# Altium schematic sheet 智能车控制板.SchDoc
size A3; SheetNumber: 1; SheetTotal: 1
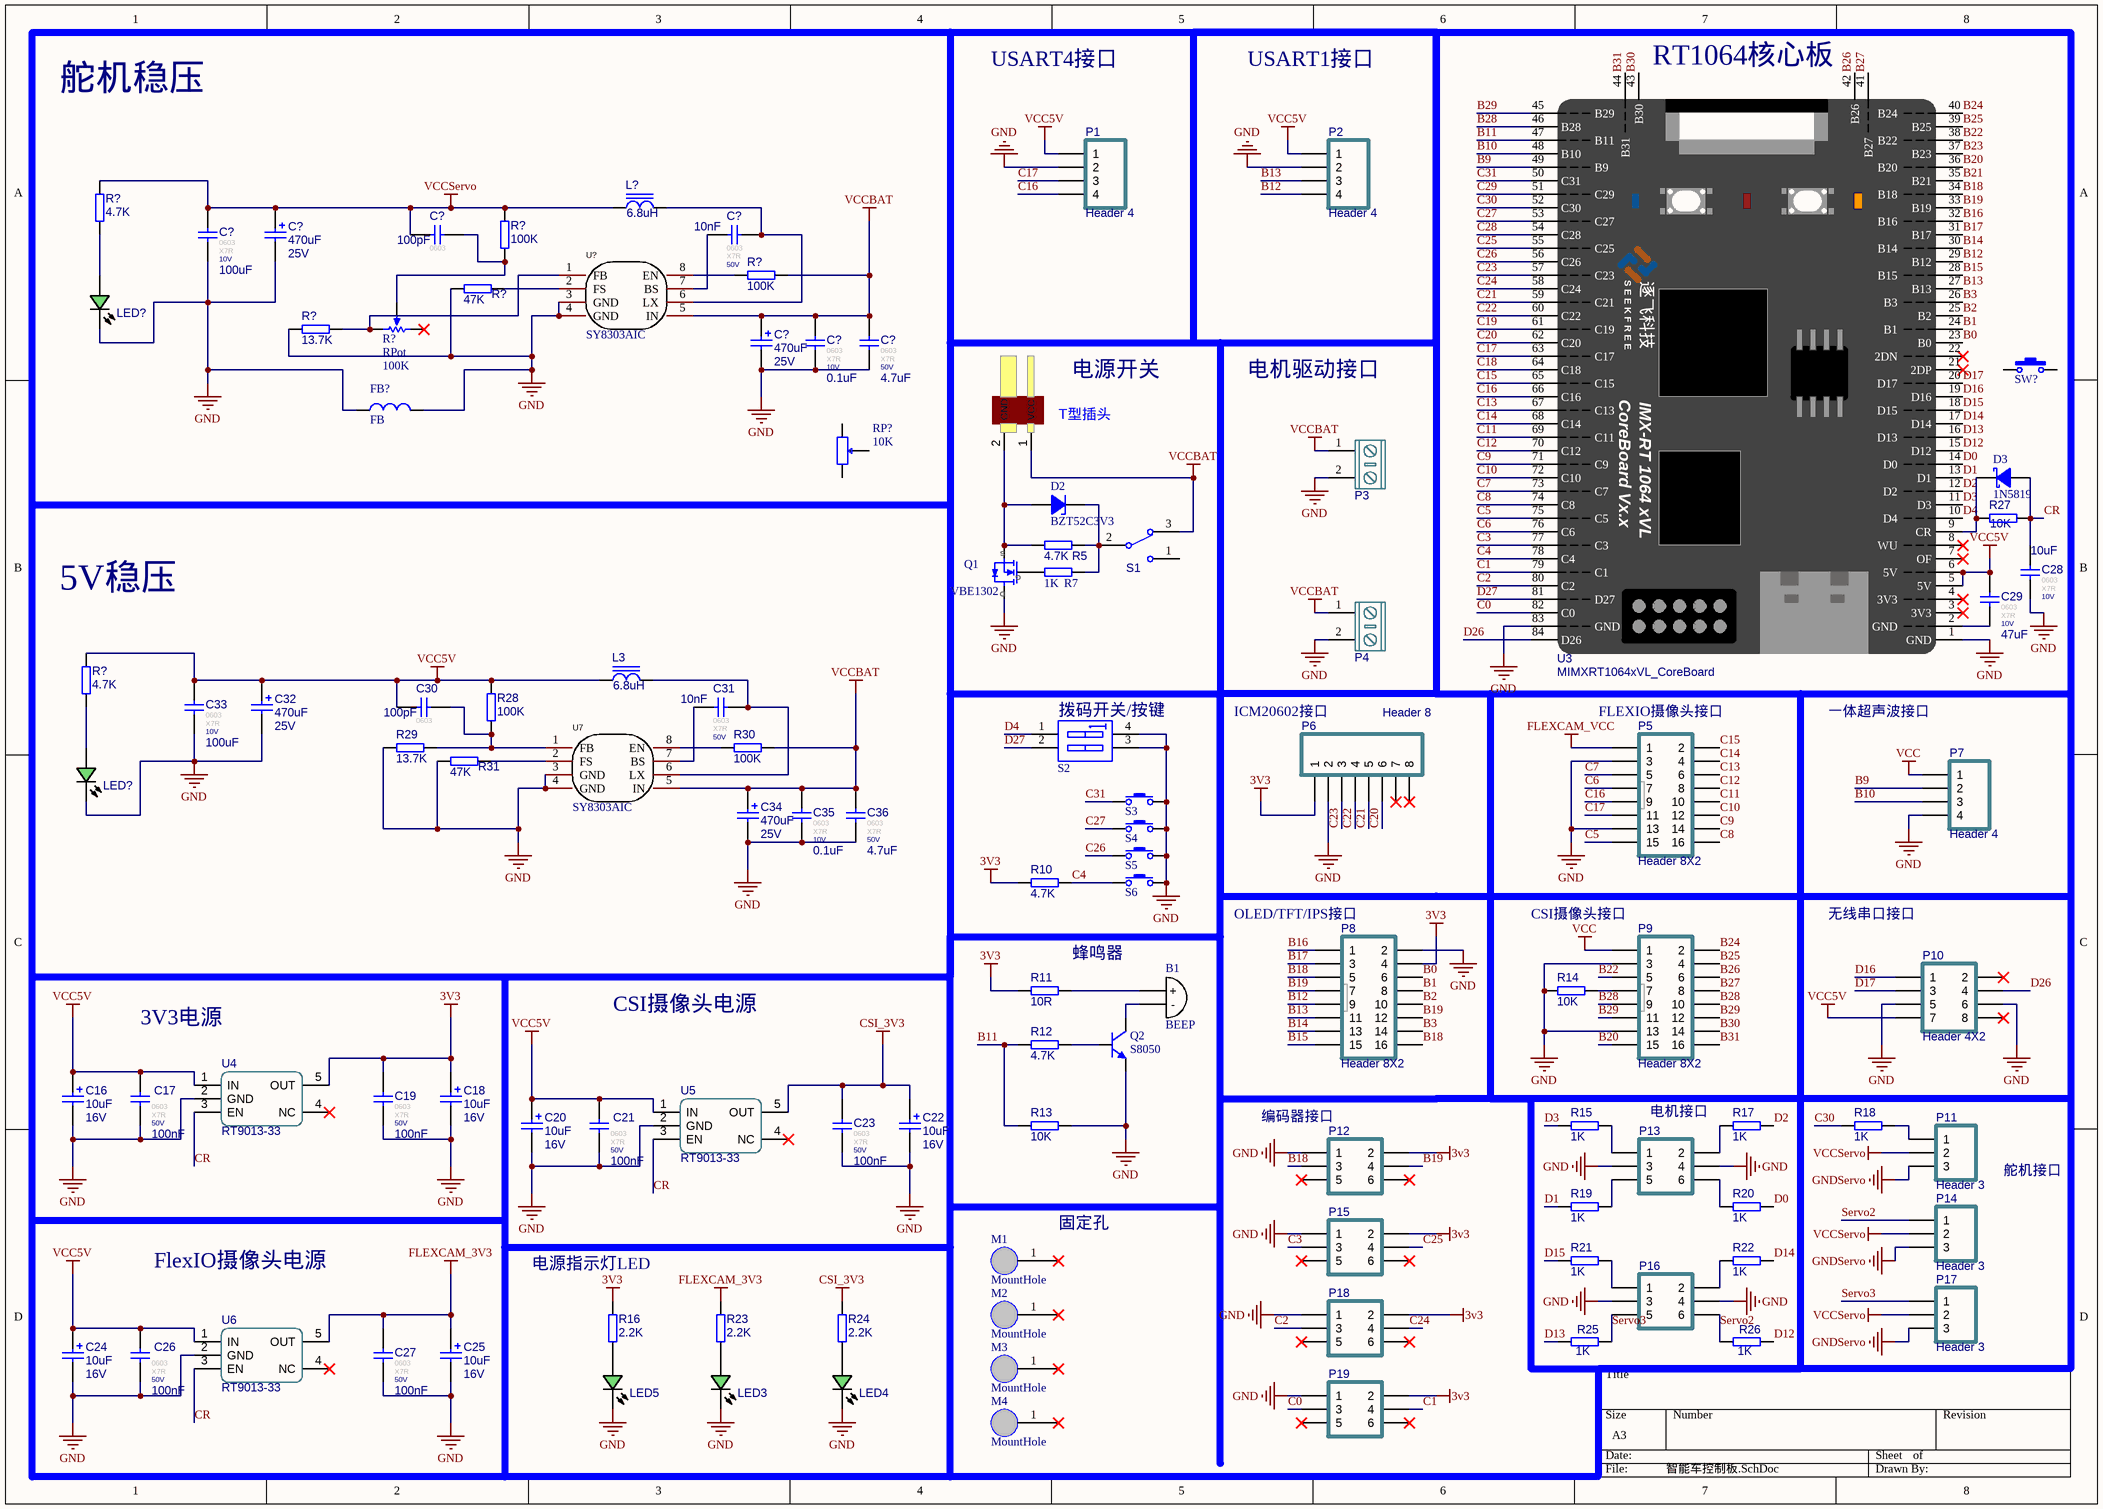
[diagram p0: 智能车控制板.SchDoc]

## Parts
(Parts that share a designator on the sheet are numbered #1, #2 ... from top to bottom, then left to right.)
B1  BEEP  [BEEP 9x5.5mm]
C16  value 10uF  Voltage: 16V  [CAPS6.3]  (hidden comment: 10uF 16V)
C17  value 100nF  Footprint: 0603  Type: X7R  Voltage: 50V  [CAPC1608[0603]S-L]  (hidden comment: 100nF ±10% 50V)
C18  value 10uF  Voltage: 16V  [CAPS6.3]  (hidden comment: 10uF 16V)
C19  value 100nF  Footprint: 0603  Type: X7R  Voltage: 50V  [CAPC1608[0603]S-L]  (hidden comment: 100nF ±10% 50V)
C20  value 10uF  Voltage: 16V  [CAPS6.3]  (hidden comment: 10uF 16V)
C21  value 100nF  Footprint: 0603  Type: X7R  Voltage: 50V  [CAPC1608[0603]S-L]  (hidden comment: 100nF ±10% 50V)
C22  value 10uF  Voltage: 16V  [CAPS6.3]  (hidden comment: 10uF 16V)
C23  value 100nF  Footprint: 0603  Type: X7R  Voltage: 50V  [CAPC1608[0603]S-L]  (hidden comment: 100nF ±10% 50V)
C24  value 10uF  Voltage: 16V  [CAPS6.3]  (hidden comment: 10uF 16V)
C25  value 10uF  Voltage: 16V  [CAPS6.3]  (hidden comment: 10uF 16V)
C26  value 100nF  Footprint: 0603  Type: X7R  Voltage: 50V  [CAPC1608[0603]S-L]  (hidden comment: 100nF ±10% 50V)
C27  value 100nF  Footprint: 0603  Type: X7R  Voltage: 50V  [CAPC1608[0603]S-L]  (hidden comment: 100nF ±10% 50V)
C28  value 10uF  Footprint: 0603  Type: X7R  Voltage: 10V  [CAPC1608[0603]S-L]  (hidden comment: 10uF ±10% 10V)
C29  value 47uF  Footprint: 0603  Type: X7R  Voltage: 10V  [CAPC1608[0603]S-L]  (hidden comment: 47uF ±10% 10V)
C30  value 100pF  Footprint: 0603  [CAPC1608[0603]S-L]  (hidden comment: 100pF ±10% 50V)
C31  value 10nF  Footprint: 0603  Type: X7R  Voltage: 50V  [CAPC1608[0603]S-L]  (hidden comment: 10nF ±10% 50V)
C32  value 470uF  Voltage: 25V  [CAPS6.3]  (hidden comment: 470uF 25V)
C33  value 100uF  Footprint: 0603  Type: X7R  Voltage: 10V  [CAPC1608[0603]S-L]  (hidden comment: 100uF ±10% 10V)
C34  value 470uF  Voltage: 25V  [CAPS6.3]  (hidden comment: 470uF 25V)
C35  value 0.1uF  Footprint: 0603  Type: X7R  Voltage: 10V  [CAPC1608[0603]S-L]  (hidden comment: 0.1uF ±10% 10V)
C36  value 4.7uF  Footprint: 0603  Type: X7R  Voltage: 50V  [CAPC1608[0603]S-L]  (hidden comment: 4.7uF ±10% 50V)
C?#1  value 470uF  Voltage: 25V  [CAPS6.3]  (hidden comment: 470uF 25V)
C?#2  value 100pF  Footprint: 0603  [CAPC1608[0603]S-L]  (hidden comment: 100pF ±10% 50V)
C?#3  value 10nF  Footprint: 0603  Type: X7R  Voltage: 50V  [CAPC1608[0603]S-L]  (hidden comment: 10nF ±10% 50V)
C?#4  value 100uF  Footprint: 0603  Type: X7R  Voltage: 10V  [CAPC1608[0603]S-L]  (hidden comment: 100uF ±10% 10V)
C?#5  value 470uF  Voltage: 25V  [CAPS6.3]  (hidden comment: 470uF 25V)
C?#6  value 0.1uF  Footprint: 0603  Type: X7R  Voltage: 10V  [CAPC1608[0603]S-L]  (hidden comment: 0.1uF ±10% 10V)
C?#7  value 4.7uF  Footprint: 0603  Type: X7R  Voltage: 50V  [CAPC1608[0603]S-L]  (hidden comment: 4.7uF ±10% 50V)
D2  BZT52C3V3  [SOD-123-L]
D3  1N5819  [SOD-123-L]
DCIN1  T型插头  [Wired T-Header ThroughHole]
FB?  FB  [FB-L0805]
L3  value 6.8uH  [0630 TPC 7*7*3]  (hidden comment: 6.8uH 5A)
L?  value 6.8uH  [0630 TPC 7*7*3]  (hidden comment: 6.8uH 5A)
LED3  翠绿贴片LED  [LEDC1608(0603)-L]  (value not drawn)
LED4  翠绿贴片LED  [LEDC1608(0603)-L]  (value not drawn)
LED5  翠绿贴片LED  [LEDC1608(0603)-L]  (value not drawn)
LED?#1  翠绿贴片LED  [LEDC1608(0603)-L]  (value not drawn)
LED?#2  翠绿贴片LED  [LEDC1608(0603)-L]  (value not drawn)
M1  MountHole  [M3-MountHole]  (no BOM)
M2  MountHole  [M3-MountHole]  (no BOM)
M3  MountHole  [M3-MountHole]  (no BOM)
M4  MountHole  [M3-MountHole]  (no BOM)
P1  Header 4  [HDR1X4]
P2  Header 4  [HDR1X4]
P3  KF/WJ/DG 30x connecter  [KF/WJ/DG 301-2p-5.0mm]  (value not drawn)
P4  KF/WJ/DG 30x connecter  [KF/WJ/DG 301-2p-5.0mm]  (value not drawn)
P5  Header 8X2  [HDR2X8-F-High]
P6  Header 8  [HDR1X8]
P7  Header 4  [HDR1X4]
P8  Header 8X2  [HDR2X8-F-High]
P9  Header 8X2  [HDR2X8-F-High]
P10  Header 4X2  [HDR2X4-F-SMT]
P11  Header 3  [HDR1X3]
P12  Header 3X2  [HDR2X3-M-SMT]  (value not drawn)
P13  Header 3X2  [HDR2X3-M-SMT]  (value not drawn)
P14  Header 3  [HDR1X3]
P15  Header 3X2  [HDR2X3-M-SMT]  (value not drawn)
P16  Header 3X2  [HDR2X3-M-SMT]  (value not drawn)
P17  Header 3  [HDR1X3]
P18  Header 3X2  [HDR2X3-M-SMT]  (value not drawn)
P19  Header 3X2  [HDR2X3-M-SMT]  (value not drawn)
Q1  VBE1302  [VBE1302]
Q2  S8050  [SOT-23]
R5  value 4.7K  [RESC1608[0603]S-L]  (hidden comment: 4.7K ±1%)
R7  value 1K  [RESC1608[0603]S-N]  (hidden comment: 1K ±1%)
R10  value 4.7K  [RESC1608[0603]S-L]  (hidden comment: 4.7K ±1%)
R11  value 10R  [RESC1608[0603]S-L]  (hidden comment: 10R ±1%)
R12  value 4.7K  [RESC1608[0603]S-L]  (hidden comment: 4.7K ±1%)
R13  value 10K  [RESC1608[0603]S-L]  (hidden comment: 10K ±1%)
R14  value 10K  [RESC1608[0603]S-L]  (hidden comment: 10K ±1%)
R15  value 1K  [RESC1608[0603]S-L]  (hidden comment: 1K ±1%)
R16  value 2.2K  [RESC1608[0603]S-L]  (hidden comment: 2.2K ±1%)
R17  value 1K  [RESC1608[0603]S-L]  (hidden comment: 1K ±1%)
R18  value 1K  [RESC1608[0603]S-L]  (hidden comment: 1K ±1%)
R19  value 1K  [RESC1608[0603]S-L]  (hidden comment: 1K ±1%)
R20  value 1K  [RESC1608[0603]S-L]  (hidden comment: 1K ±1%)
R21  value 1K  [RESC1608[0603]S-L]  (hidden comment: 1K ±1%)
R22  value 1K  [RESC1608[0603]S-L]  (hidden comment: 1K ±1%)
R23  value 2.2K  [RESC1608[0603]S-L]  (hidden comment: 2.2K ±1%)
R24  value 2.2K  [RESC1608[0603]S-L]  (hidden comment: 2.2K ±1%)
R25  value 1K  [RESC1608[0603]S-L]  (hidden comment: 1K ±1%)
R26  value 1K  [RESC1608[0603]S-L]  (hidden comment: 1K ±1%)
R27  value 10K  [RESC1608[0603]S-L]  (hidden comment: 10K ±1%)
R28  value 100K  [RESC1608[0603]S-L]  (hidden comment: 100K ±1%)
R29  value 13.7K  [RESC1608[0603]S-L]  (hidden comment: 13.7K ±1%)
R30  value 100K  [RESC1608[0603]S-L]  (hidden comment: 100K ±1%)
R31  value 47K  [RESC1608[0603]S-L]  (hidden comment: 47K ±1%)
R?#1  value 4.7K  [RESC1608[0603]S-L]  (hidden comment: 4.7K ±1%)
R?#2  value 100K  [RESC1608[0603]S-L]  (hidden comment: 100K ±1%)
R?#3  value 100K  [RESC1608[0603]S-L]  (hidden comment: 100K ±1%)
R?#4  value 47K  [RESC1608[0603]S-L]  (hidden comment: 47K ±1%)
R?#5  RPot  value 100K  [VR5]
R?#6  value 13.7K  [RESC1608[0603]S-L]  (hidden comment: 13.7K ±1%)
R?#7  value 4.7K  [RESC1608[0603]S-L]  (hidden comment: 4.7K ±1%)
RP?  10K  [WH148-1-G25]
S1  SW-SPDT  [SS12D10]  (value not drawn)
S2  SW DIP-2  [Code SW-2-DIP-2.54]  (value not drawn)
S3  Button  [PTS810-3*4-CurvePin]  (value not drawn)
S4  Button  [PTS810-3*4-CurvePin]  (value not drawn)
S5  Button  [PTS810-3*4-CurvePin]  (value not drawn)
S6  Button  [PTS810-3*4-CurvePin]  (value not drawn)
SW?  3x6x5  [SW SMD-3*6*2.5]  (value not drawn)
U3  MIMXRT1064xVL_CoreBoard  [MIMXRT1064xVL_CoreBoard - 3D]
U4  RT9013-33  [SOT-23-5]
U5  RT9013-33  [SOT-23-5]
U6  RT9013-33  [SOT-23-5]
U7  SY8303AIC  [TSOT-23-8_L2.9-W1.6-P0.65-LS2.8-BR]
U?  SY8303AIC  [TSOT-23-8_L2.9-W1.6-P0.65-LS2.8-BR]

## Nets
3V3: C18.1 C19.2 P6.1 P8.4 P12.2 P15.2 P18.2 P19.2 R10.1 R11.2 R16.2 U4.5(OUT)
CSI_3V3: C22.1 C23.2 R24.2 U5.5(OUT)
FLEXCAM_3V3: C25.1 C27.2 R23.2 U6.5(OUT)
FLEXCAM_VCC: P5.1
GND: C16.2 C17.1 C18.2 C19.1 C20.2 C21.1 C22.2 C23.1 C24.2 C25.2 C26.1 C27.1 C28.1 C32.2 C33.1 C34.2 C35.1 C36.1 C?#1.2 C?#4.1 C?#5.2 C?#6.1 C?#7.1 FB?.1 FB?.2 LED3.C LED4.C LED5.C LED?#1.C LED?#2.C P1.2 P2.2 P3.2 P4.2 P5.3 P5.13 P6.2 P7.4 P8.2 P9.3 P9.13 P10.5 P10.6 P12.1 P13.3 P13.4 P15.1 P16.3 P16.4 P18.1 P19.1 Q1.1(D) Q2.2(E) R13.1 R14.2 R29.2 R31.2 R?#4.2 R?#6.2 S2.3(B2) S2.4(B1) S3.1 S4.1 S5.1 S6.1 U3.1(GND) U3.83(GND) U4.2(GND) U5.2(GND) U6.2(GND) U7.3(GND) U7.4(GND) U?.3(GND) U?.4(GND)
GNDServo: P11.3 P14.3 P17.3
VCC: P7.1 P9.1
VCC5V: C16.1 C17.2 C20.1 C21.2 C24.1 C26.2 C29.2 C30.1 C32.1 C33.2 L3.1 P1.1 P2.1 P10.7 R28.2 R?#7.2 U3.5(5V) U3.6(5V) U4.1(IN) U5.1(IN) U6.1(IN)
VCCBAT: C34.1 C35.2 C36.2 C?#5.1 C?#6.2 C?#7.2 DCIN1.1(VCC) P3.1 P4.1 R30.1 R?#3.1 S1.3 U7.5(IN) U?.5(IN)
VCCServo: C?#1.1 C?#2.1 C?#4.2 L?.1 P11.2 P14.2 P17.2 R?#1.2 R?#2.2
B0: P8.6 U3.23(B0)
B1: P8.8 U3.24(B1)
B2: P8.10 U3.25(B2)
B3: P8.14 U3.26(B3)
B9: P7.2 U3.49(B9)
B10: P7.3 U3.48(B10)
B11: R12.2 R13.2 U3.47(B11)
B12: P2.4 P8.9 U3.29(B12)
B13: P2.3 P8.11 U3.27(B13)
B14: P8.13 U3.30(B14)
B15: P8.15 U3.28(B15)
B16: P8.1 U3.32(B16)
B17: P8.3 U3.31(B17)
B18: P8.5 P8.16 P12.3 U3.34(B18)
B19: P8.7 P8.12 P12.4 U3.33(B19)
B20: P9.15 U3.36(B20)
B21: U3.35(B21)
B22: P9.5 U3.38(B22)
B23: U3.37(B23)
B24: P9.2 U3.40(B24)
B25: P9.4 U3.39(B25)
B26: P9.6 U3.42(B26)
B27: P9.8 U3.41(B27)
B28: P9.9 P9.10 U3.46(B28)
B29: P9.11 P9.12 U3.45(B29)
B30: P9.14 U3.43(B30)
B31: P9.16 U3.44(B31)
C0: P19.3 U3.82(C0)
C1: P19.4 U3.79(C1)
C2: P18.3 U3.80(C2)
C3: P15.3 U3.77(C3)
C4: R10.2 S6.2 U3.78(C4)
C5: P5.15 U3.75(C5)
C6: P5.7 U3.76(C6)
C7: P5.5 U3.73(C7)
C8: P5.16 U3.74(C8)
C9: P5.14 U3.71(C9)
C10: P5.12 U3.72(C10)
C11: P5.10 U3.69(C11)
C12: P5.8 U3.70(C12)
C13: P5.6 U3.67(C13)
C14: P5.4 U3.68(C14)
C15: P5.2 U3.65(C15)
C16: P1.4 P5.9 U3.66(C16)
C17: P1.3 P5.11 U3.63(C17)
C18: U3.64(C18)
C19: U3.61(C19)
C20: P6.6 U3.62(C20)
C21: P6.5 U3.59(C21)
C22: P6.4 U3.60(C22)
C23: P6.3 U3.57(C23)
C24: P18.4 U3.58(C24)
C25: P15.4 U3.55(C25)
C26: S5.2 U3.56(C26)
C27: S4.2 U3.53(C27)
C28: U3.54(C28)
C29: U3.51(C29)
C30: R18.2 U3.52(C30)
C31: S3.2 U3.50(C31)
CR: C28.2 D3.A R27.1 U4.3(EN) U5.3(EN) U6.3(EN)
D0: R20.1 U3.14(D0)
D1: R19.2 U3.13(D1)
D2: R17.1 U3.12(D2)
D3: R15.2 U3.11(D3)
D4: S2.1(A1) U3.10(D4)
D12: R26.1 U3.15(D12)
D13: R25.2 U3.16(D13)
D14: R22.1 U3.17(D14)
D15: R21.2 U3.18(D15)
D16: P10.1 U3.19(D16)
D17: P10.3 U3.20(D17)
D26: P10.4 U3.84(D26)
D27: S2.2(A2) U3.81(D27)
Servo2: P14.1 P16.6 R26.2
Servo3: P16.5 P17.1 R25.1
NetB1_1: B1.1(+) R11.1
NetB1_2: B1.2(-) Q2.3(C)
NetC29_1: C29.1 U3.2(GND)
NetC30_2: C30.2 R28.1 R29.1 U7.1(FB)
NetC31_1: C31.1 L3.2 U7.6(LX)
NetC31_2: C31.2 U7.7(BS)
NetC?#2_2: C?#2.2 R?#2.1 R?#5.3(TAP)
NetC?#3_1: C?#3.1 L?.2 U?.6(LX)
NetC?#3_2: C?#3.2 U?.7(BS)
NetD2_A: D2.A DCIN1.2(GND) Q1.3(S) R5.1
NetD2_K: D2.K R5.2 R7.2 S1.2
NetD3_K: D3.K R27.2 U3.9(CR)
NetLED3_A: LED3.A R23.1
NetLED4_A: LED4.A R24.1
NetLED5_A: LED5.A R16.1
NetLED?#1_A: LED?#1.A R?#1.1
NetLED?#2_A: LED?#2.A R?#7.1
NetP9_7: P9.7 R14.1
NetP11_1: P11.1 R18.1
NetP13_1: P13.1 R15.1
NetP13_2: P13.2 R17.2
NetP13_5: P13.5 R19.1
NetP13_6: P13.6 R20.2
NetP16_1: P16.1 R21.1
NetP16_2: P16.2 R22.2
NetQ1_2: Q1.2(G) R7.1
NetQ2_1: Q2.1(B) R12.1
NetR30_2: R30.2 U7.8(EN)
NetR31_1: R31.1 U7.2(FS)
NetR?#3_2: R?#3.2 U?.8(EN)
NetR?#4_1: R?#4.1 U?.2(FS)
NetR?#5_2: R?#5.2(BOT) R?#6.1 U?.1(FB)

Not connected (* = marked no-connect by the designer): M1 1*; M2 1*; M3 1*; M4 1*; P6 7* 8*; P10 2* 8*; P12 5* 6*; P15 5* 6*; P18 5* 6*; P19 5* 6*; R?#5 1(TOP)*; RP? 1 2 3; S1 1; SW? 1 2; U3 3(3V3)* 4(3V3)* 7(OF)* 8(WU)* 21(2DP)* 22(2DN)*; U4 4(NC)*; U5 4(NC)*; U6 4(NC)*

## Notes on the sheet
- 舵机稳压
- USART4接口
- USART1接口
- (near U3) RT1064核心板
- 电源开关
- 电机驱动接口
- 5V稳压
- (near S2) 拨码开关/按键
- ICM20602接口
- (near P5) FLEXIO摄像头接口
- 一体超声波接口
- (near P8) OLED/TFT/IPS接口
- CSI摄像头接口
- 无线串口接口
- (near R11) 蜂鸣器
- 3V3电源
- CSI摄像头电源
- (near P12) 编码器接口
- 电机接口
- 舵机接口
- (near M1) 固定孔
- FlexIO摄像头电源
- (near R16) 电源指示灯LED
- (in symbol MIMXRT1064xVL_CoreBoard) S E E K F R E E; 逐飞科技; CoreBoard Vx.x; IMX-RT 1064 xVL

## Library data of the parts
B1 = BEEP: 蜂鸣器
C16 C18 C20 C22 C24 C25 C32 C34 C?#1 C?#5 = Cap-Solid: Polarized Capacitor (Radial); Published: 8-Jun-2000; Revision: July-2002: Re-released for DXP Platform.; Publisher: Altium Limited; Price(RMB): 0.000
C17 C19 C21 C23 C26 C27 C31 C36 C?#3 C?#7 = Cap-Chip_2: 贴片电容; Published: 2021-12-13; Revision: V1.2; Tolerance: ±10%
C28 C29 C33 C35 C?#4 C?#6 = Cap-Chip: 贴片电容; Published: 2021-12-13; Revision: V1.2; Tolerance: ±10%
C30 C?#2 = Cap-Chip_2: 贴片电容; Type: X7R; Published: 2021-12-13; Revision: V1.2; Tolerance: ±10%; Voltage: 50V
D2 = Diode Zen: 3.3V稳压二极管 SOD-123; Published: 8-Jun-2000; Revision: July-2002: Re-released for DXP Platform.; Publisher: Altium Limited; Price(RMB): 0.000
D3 = Diode Schottky: 肖特基二极管 Diode; Imax: 500mA; Published: 8-Jun-2000; Revision: July-2002: Re-released for DXP Platform.; Publisher: Altium Limited; Price(RMB): 0.000; PartNumber: 1N5819
DCIN1 = T_Header
FB? = FB: 磁珠
L3 L? = Ind-Power: 功率电感; DCR: .5m; Published: 8-Jun-2000; Revision: July-2002: Re-released for DXP Platform.; Publisher: Altium Limited; Price(RMB): 0.000; Imax: 5A
LED3-LED5 LED?#1 LED?#2 = LED Chip Green: Published: 8-Jun-2000; Revision: July-2002: Re-released for DXP Platform.; Publisher: Altium Limited; Price(RMB): 0.00
M1-M4 = MountHole: 固定孔
P1 P2 P7 = Header 4: Header, 4-Pin; LatestRevisionDate: 17-Jul-2002; LatestRevisionNote: Re-released for DXP Platform.; Publisher: Altium Limited; Price(RMB): 0.00
P3 P4 = KF/WJ/DG 30x: 接线端子 2Pin
P5 P8 P9 = Header 8X2: Header, 8-Pin, Dual row; LatestRevisionDate: 17-Jul-2002; LatestRevisionNote: Re-released for DXP Platform.; Publisher: Altium Limited; Price(RMB): 0.00
P6 = Header 8: 8Pin 排针 ICM20602接口; LatestRevisionDate: 17-Jul-2002; LatestRevisionNote: Re-released for DXP Platform.; Publisher: Altium Limited; Price(RMB): 0.00
P10 = Header 4X2: Header, 4-Pin, Dual row; LatestRevisionDate: 17-Jul-2002; LatestRevisionNote: Re-released for DXP Platform.; Publisher: Altium Limited; Price(RMB): 0.00
P11 P14 P17 = Header 3: Header, 3-Pin; LatestRevisionDate: 17-Jul-2002; LatestRevisionNote: Re-released for DXP Platform.; Publisher: Altium Limited; Price(RMB): 0.00
P12 P13 P15 P16 P18 P19 = Header 3X2: Header, 3-Pin, Dual row; LatestRevisionDate: 17-Jul-2002; LatestRevisionNote: Re-released for DXP Platform.; Publisher: Altium Limited; Price(RMB): 0.00
Q2 = NPN S8050: Discrete NPN Bipolar Transistor; Published: 8-Jun-2000; Revision: July-2002: Re-released for DXP Platform.; Publisher: Altium Limited; Price(RMB): 0.000; PartNumber: S8050
R5 = Res-Chip_3: 贴片电阻; Published: 8-Jun-2000; Revision: July-2002: Re-released for DXP Platform.; Tolerance: ±1%
R7 = Res-Chip_2: 贴片电阻; Published: 8-Jun-2000; Revision: July-2002: Re-released for DXP Platform.; Publisher: Altium Limited; Price(RMB): 0.000; Tolerance: ±1%
R10-R31 R?#1-R?#4 R?#6 R?#7 = Res-Chip_6: 贴片电阻; Published: 8-Jun-2000; Revision: July-2002: Re-released for DXP Platform.; Tolerance: ±1%
R?#5 = RPot: Potentiometer; Sim Note: Enter the Resistance value and the set point into parameter fields.; Set Position: 0.5; Published: 8-Jun-2000; LatestRevisionDate: 17-Jul-2002; LatestRevisionNote: Re-released for DXP Platform.; PackageReference: VR5; Publisher: Altium Limited; PackageDescription: Variable Resistor, Thru-Hole; 3 Leads
RP? = R-RP: 单联电位器; BOM名称: 插件电位器
S1 = SW-SPDT: 单刀双掷开关 3脚船型、钮子、拨动开关 SPDT Subminiature Toggle Switch; Published: 24-Mar-1999; Publisher: Altium Limited; Price(RMB): 0.000
S2 = Code SW-2: 2位拨码开关; Published: 24-Mar-1999; Revision: July-2002: Re-released for DXP Platform.; Publisher: Altium Limited; Price(RMB): 0.000
S3-S6 = KEY: 按键; Published: 24-Mar-1999; Publisher: Altium Limited; Price(RMB): 0.000
SW? = SW-PB: 微动开关; BOM名称: 3x6轻触开关
U3 = MIMXRT1064xVL_CoreBoard: 逐飞科技i.MX RT1064核心板整体原理，可直接使用
U4-U6 = RT9013-33: 3.3V 500mA SOT-23-5 LDO
U7 U? = SY8303AIC: Manufacturer: silergy(矽力杰); Add into BOM: yes; Function: 降压型; Name: SY8303AIC; Symbol: SY8303AIC; Device: SY8303AIC; LCSC Part Name: 降压型; Supplier Part: C97054; Manufacturer Part: SY8303AIC; Supplier Footprint: TSOT-23-8; JLCPCB Part Class: Extended Part; Datasheet: https://atta.szlcsc.com/upload/public/pdf/source/20170308/1488958431714.pdf; Supplier: LCSC; Convert to PCB: yes; Synchronous Rectification: -; Number of Outputs: -; Topology: -; Input Voltage: -; Output Current (Max): -; Switching Frequency: -